# EAGLE schematic PowerloggerSch (EAGLE 9.7.0)

## Sheet 1 of 3
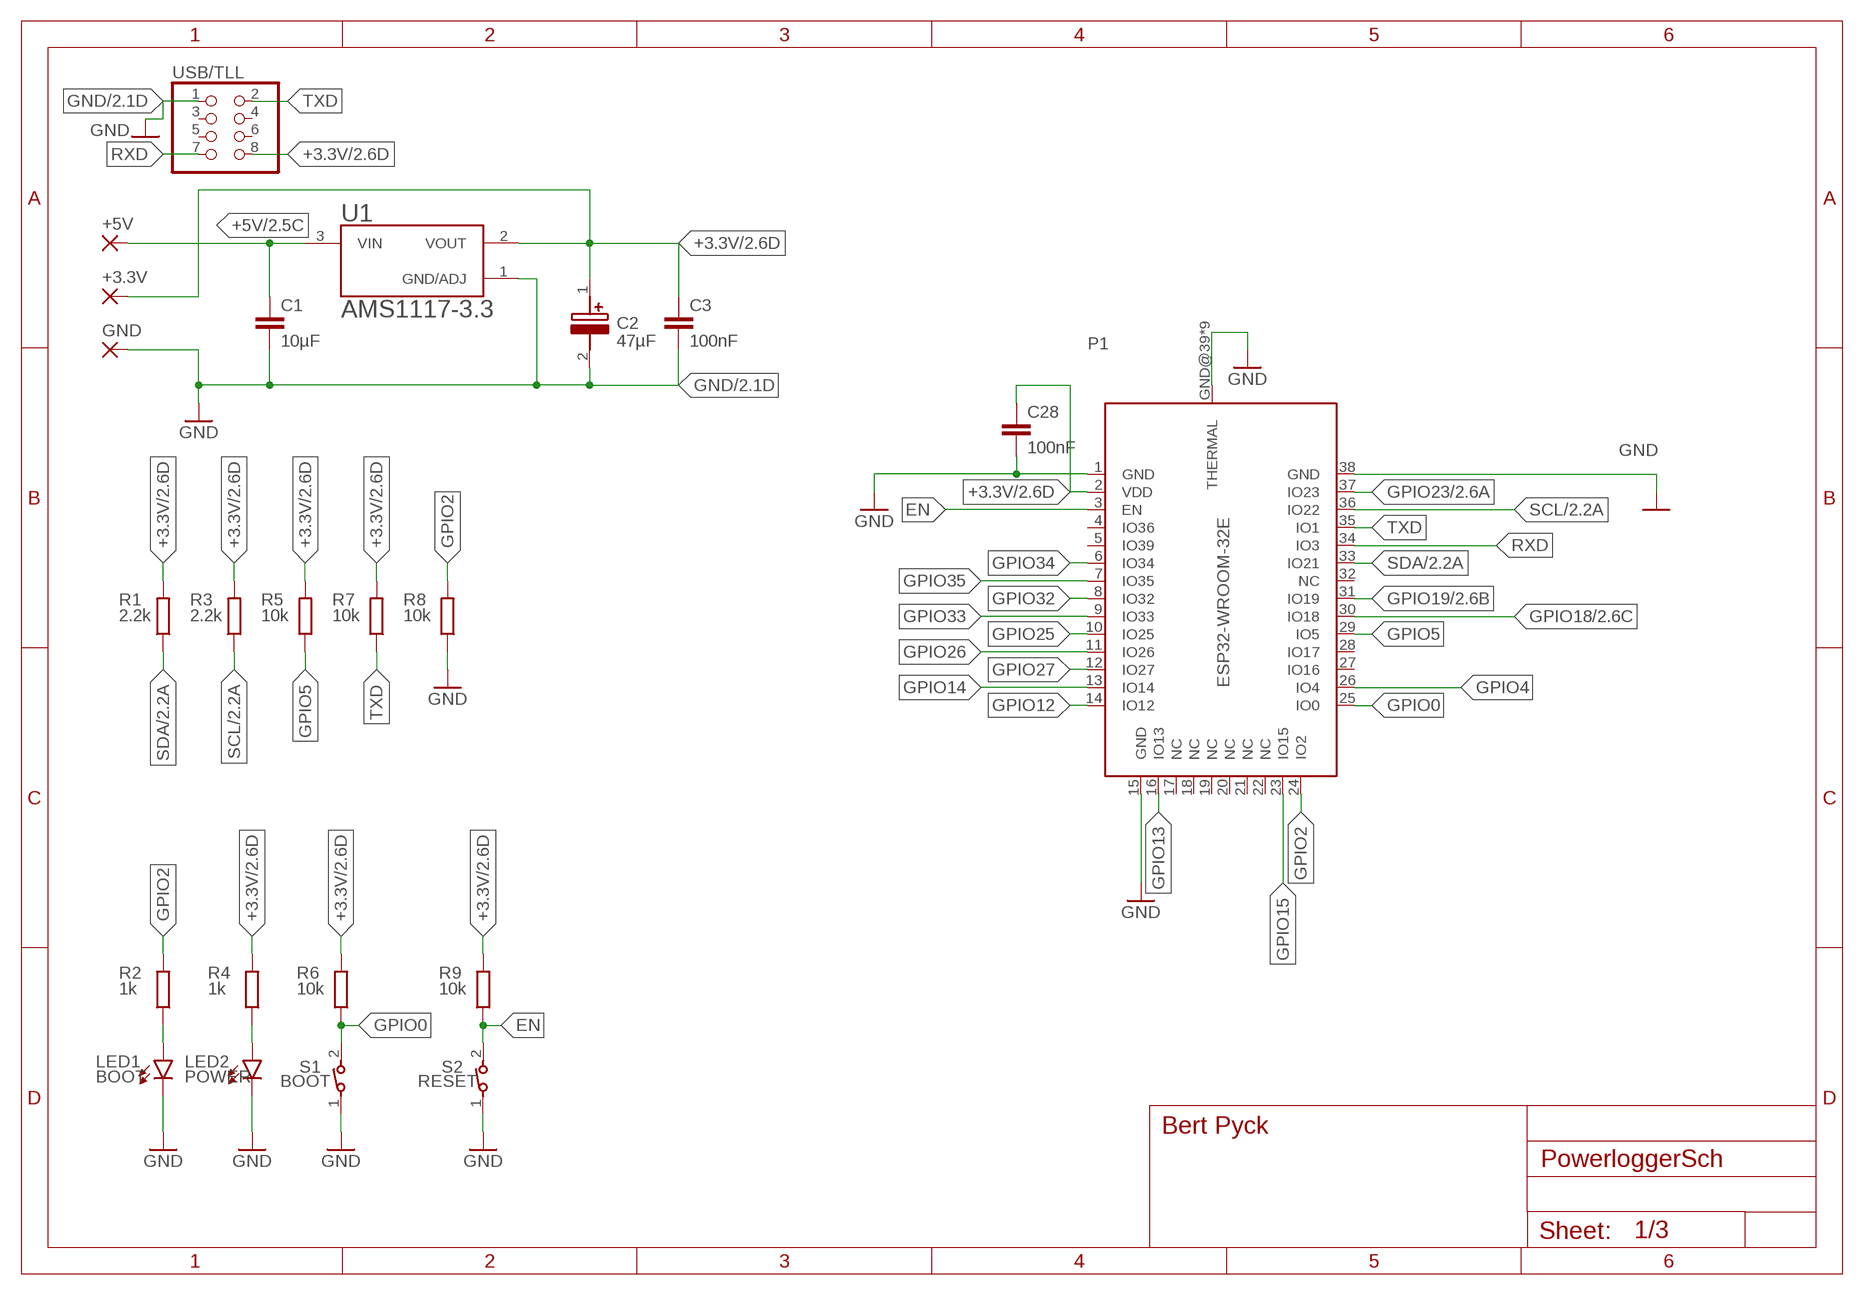
[diagram p0: schematic, sheet 1]

### Parts
+3.3V  SOLDERPAD  [SOLDERPAD]
+5V  SOLDERPAD  [SOLDERPAD]
C1  10µF  C-EUC1206  [C1206]
C2  47µF  865080543009  [CAPAE660X550N]
C3  100nF  C-EUC1206  [C1206]
C28  100nF  C-EUC1206  [C1206]
GND  SOLDERPAD  [SOLDERPAD]
LED1  BOOT  LEDCHIPLED_1206  [CHIPLED_1206]
LED2  POWER  LEDCHIPLED_1206  [CHIPLED_1206]
P1  ESP32-WROOM-32E  [ESP32-WROOM-32E]
R1  2.2k  R-EU_R1206  [R1206]
R2  1k  R-EU_R1206  [R1206]
R3  2.2k  R-EU_R1206  [R1206]
R4  1k  R-EU_R1206  [R1206]
R5  10k  R-EU_R1206  [R1206]
R6  10k  R-EU_R1206  [R1206]
R7  10k  R-EU_R1206  [R1206]
R8  10k  R-EU_R1206  [R1206]
R9  10k  R-EU_R1206  [R1206]
S1  BOOT  434111043826  [434111043826]
S2  RESET  434111043826  [434111043826]
U1  AMS1117-3.3  [SOT229P700X180-4N]
USB/TLL  PINHD-2X4  [2X04]

### Nets
+3.3V: +3.3V.1(P) C2.1(+) C3.1 C28.1 P1.2(VDD) R1.2 R3.2 R4.2 R5.2 R6.2 R7.2 R9.2 U1.2(VOUT) USB/TLL.8 ; also sheet 2
+5V: +5V.1(P) C1.1 U1.3(VIN) ; also sheet 2,3
EN: P1.3(EN) R9.1 S2.2
GND: C1.2 C2.2(-) C3.2 C28.2 GND.1(P) LED1.C LED2.C P1.1(GND) P1.15(GND) P1.38(GND) P1.GND@39(THERMAL) P1.GND@40(THERMAL) P1.GND@41(THERMAL) P1.GND@42(THERMAL) P1.GND@43(THERMAL) P1.GND@44(THERMAL) P1.GND@45(THERMAL) P1.GND@46(THERMAL) P1.GND@47(THERMAL) R8.1 S1.1 S2.1 U1.1(GND/ADJ) USB/TLL.1 ; also sheet 2,3
GPIO0: P1.25(IO0) R6.1 S1.2
GPIO2: P1.24(IO2) R2.2 R8.2
GPIO4: P1.26(IO4)
GPIO5: P1.29(IO5) R5.1
GPIO12: P1.14(IO12)
GPIO13: P1.16(IO13)
GPIO14: P1.13(IO14)
GPIO15: P1.23(IO15)
GPIO18: P1.30(IO18) ; also sheet 2
GPIO19: P1.31(IO19) ; also sheet 2
GPIO23: P1.37(IO23) ; also sheet 2
GPIO25: P1.10(IO25)
GPIO26: P1.11(IO26)
GPIO27: P1.12(IO27)
GPIO32: P1.8(IO32)
GPIO33: P1.9(IO33)
GPIO34: P1.6(IO34)
GPIO35: P1.7(IO35)
N$1: LED1.A R2.1
N$2: LED2.A R4.1
RXD: P1.34(IO3) USB/TLL.7
SCL: P1.36(IO22) R3.1 ; also sheet 2
SDA: P1.33(IO21) R1.1 ; also sheet 2
TXD: P1.35(IO1) R7.1 USB/TLL.2
Unconnected: P1.4(IO36) P1.5(IO39) P1.17(NC) P1.18(NC) P1.19(NC) P1.20(NC) P1.21(NC) P1.22(NC) P1.27(IO16) P1.28(IO17) P1.32(NC) USB/TLL.3 USB/TLL.4 USB/TLL.5 USB/TLL.6

### Notes on the sheet
- Bert Pyck

## Sheet 2 of 3
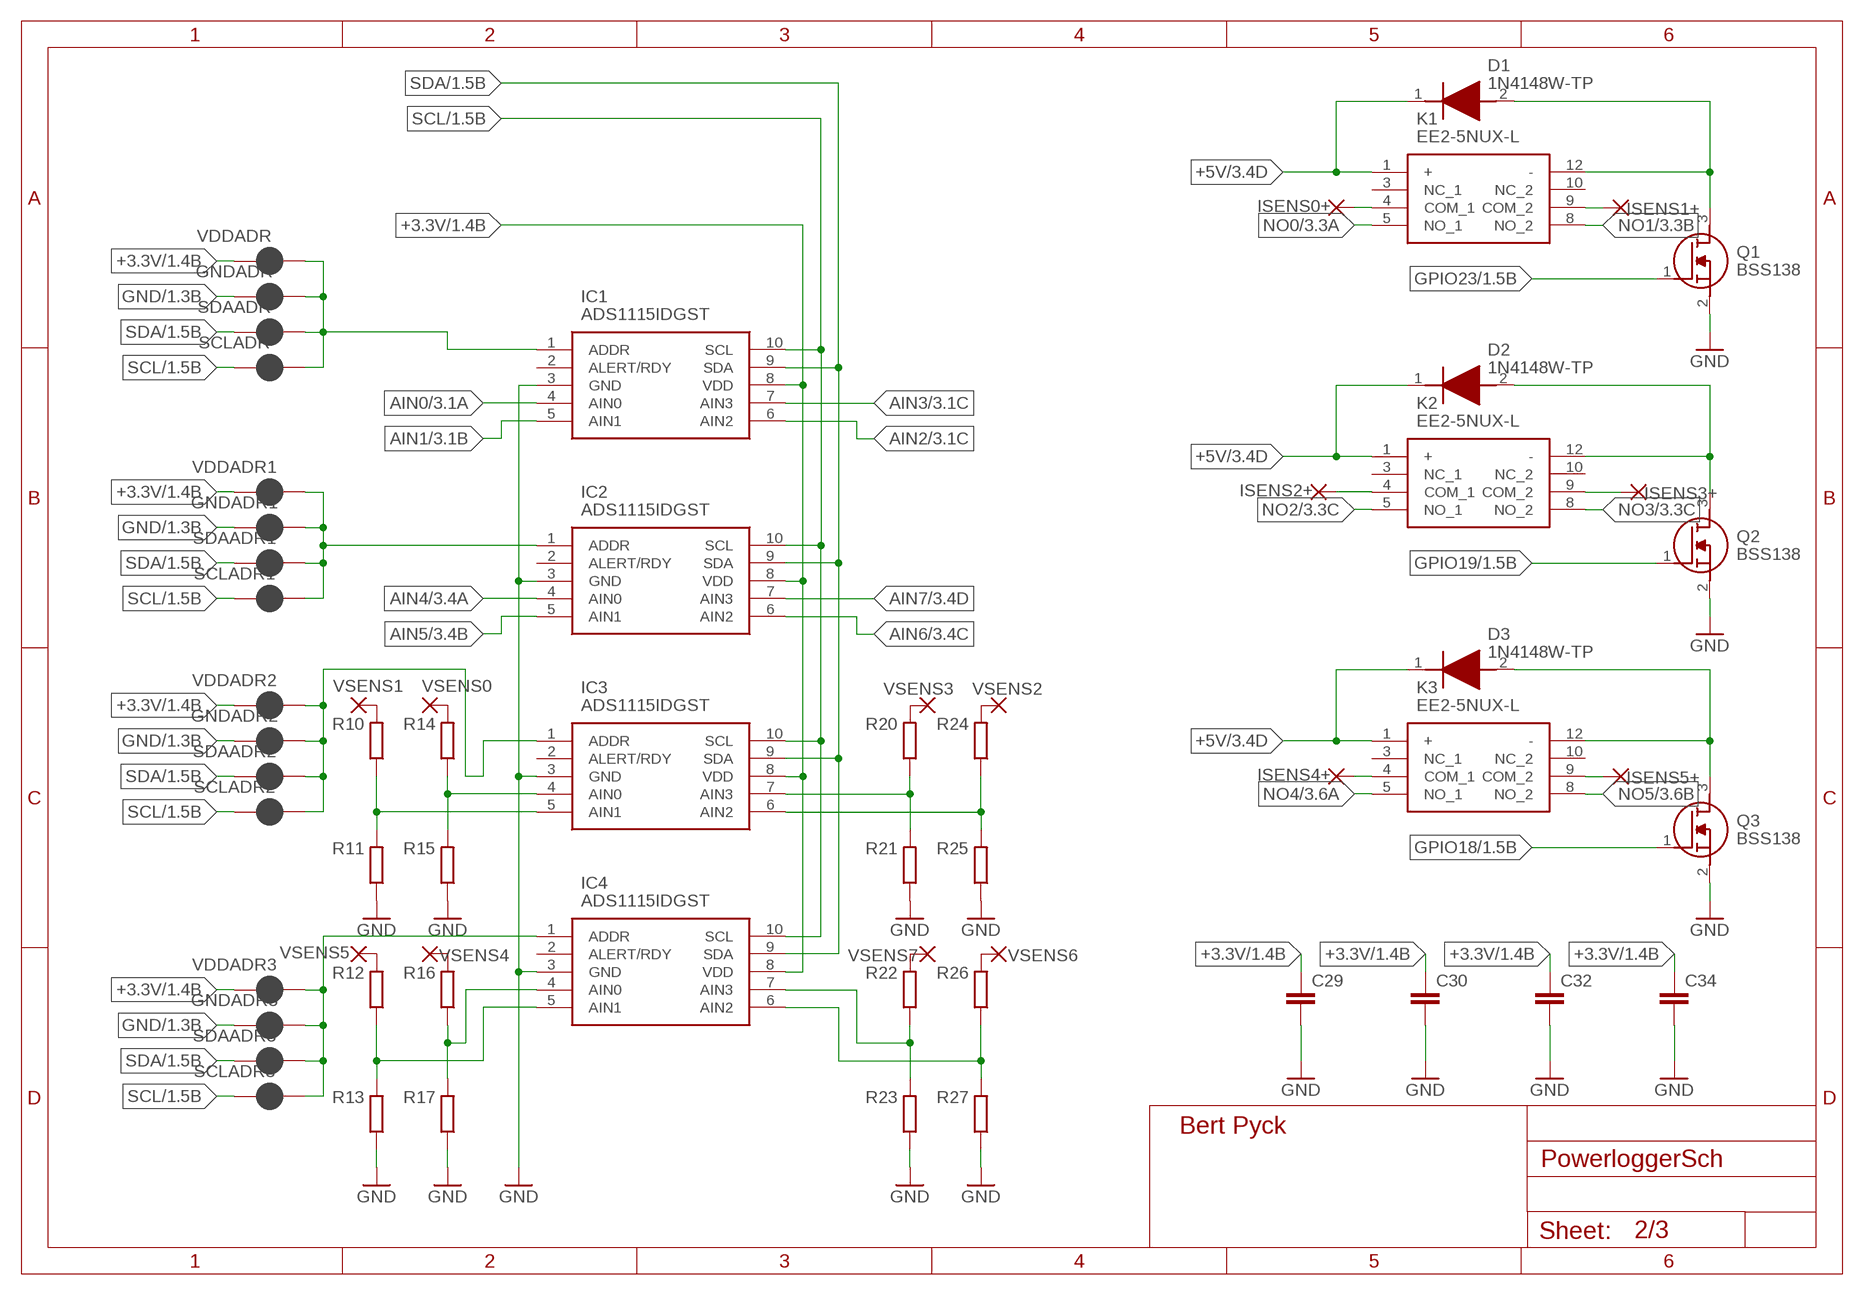
[diagram p1: schematic, sheet 2]

### Parts
C29  100nF  C-EUC1206  [C1206]
C30  100nF  C-EUC1206  [C1206]
C32  100nF  C-EUC1206  [C1206]
C34  100nF  C-EUC1206  [C1206]
D1  1N4148W-TP  [SOD3715X135N]
D2  1N4148W-TP  [SOD3715X135N]
D3  1N4148W-TP  [SOD3715X135N]
GNDADR  JUMPER-SMT_2_NC_PASTE_SILK  [SMT-JUMPER_2_NC_PASTE_SILK]
GNDADR1  JUMPER-SMT_2_NC_PASTE_SILK  [SMT-JUMPER_2_NC_PASTE_SILK]
GNDADR2  JUMPER-SMT_2_NC_PASTE_SILK  [SMT-JUMPER_2_NC_PASTE_SILK]
GNDADR3  JUMPER-SMT_2_NC_PASTE_SILK  [SMT-JUMPER_2_NC_PASTE_SILK]
IC1  ADS1115IDGST  [SOP50P490X110-10N]
IC2  ADS1115IDGST  [SOP50P490X110-10N]
IC3  ADS1115IDGST  [SOP50P490X110-10N]
IC4  ADS1115IDGST  [SOP50P490X110-10N]
ISENS0+  SOLDERPAD  [SOLDERPAD]
ISENS1+  SOLDERPAD  [SOLDERPAD]
ISENS2+  SOLDERPAD  [SOLDERPAD]
ISENS3+  SOLDERPAD  [SOLDERPAD]
ISENS4+  SOLDERPAD  [SOLDERPAD]
ISENS5+  SOLDERPAD  [SOLDERPAD]
K1  EE2-5NUX-L  [EE25NUXL]
K2  EE2-5NUX-L  [EE25NUXL]
K3  EE2-5NUX-L  [EE25NUXL]
Q1  BSS138  [SOT95P240X120-3N]
Q2  BSS138  [SOT95P240X120-3N]
Q3  BSS138  [SOT95P240X120-3N]
R10  R-EU_R1206  [R1206]
R11  R-EU_R1206  [R1206]
R12  R-EU_R1206  [R1206]
R13  R-EU_R1206  [R1206]
R14  R-EU_R1206  [R1206]
R15  R-EU_R1206  [R1206]
R16  R-EU_R1206  [R1206]
R17  R-EU_R1206  [R1206]
R20  R-EU_R1206  [R1206]
R21  R-EU_R1206  [R1206]
R22  R-EU_R1206  [R1206]
R23  R-EU_R1206  [R1206]
R24  R-EU_R1206  [R1206]
R25  R-EU_R1206  [R1206]
R26  R-EU_R1206  [R1206]
R27  R-EU_R1206  [R1206]
SCLADR  JUMPER-SMT_2_NC_PASTE_SILK  [SMT-JUMPER_2_NC_PASTE_SILK]
SCLADR1  JUMPER-SMT_2_NC_PASTE_SILK  [SMT-JUMPER_2_NC_PASTE_SILK]
SCLADR2  JUMPER-SMT_2_NC_PASTE_SILK  [SMT-JUMPER_2_NC_PASTE_SILK]
SCLADR3  JUMPER-SMT_2_NC_PASTE_SILK  [SMT-JUMPER_2_NC_PASTE_SILK]
SDAADR  JUMPER-SMT_2_NC_PASTE_SILK  [SMT-JUMPER_2_NC_PASTE_SILK]
SDAADR1  JUMPER-SMT_2_NC_PASTE_SILK  [SMT-JUMPER_2_NC_PASTE_SILK]
SDAADR2  JUMPER-SMT_2_NC_PASTE_SILK  [SMT-JUMPER_2_NC_PASTE_SILK]
SDAADR3  JUMPER-SMT_2_NC_PASTE_SILK  [SMT-JUMPER_2_NC_PASTE_SILK]
VDDADR  JUMPER-SMT_2_NC_PASTE_SILK  [SMT-JUMPER_2_NC_PASTE_SILK]
VDDADR1  JUMPER-SMT_2_NC_PASTE_SILK  [SMT-JUMPER_2_NC_PASTE_SILK]
VDDADR2  JUMPER-SMT_2_NC_PASTE_SILK  [SMT-JUMPER_2_NC_PASTE_SILK]
VDDADR3  JUMPER-SMT_2_NC_PASTE_SILK  [SMT-JUMPER_2_NC_PASTE_SILK]
VSENS0  SOLDERPAD  [SOLDERPAD]
VSENS1  SOLDERPAD  [SOLDERPAD]
VSENS2  SOLDERPAD  [SOLDERPAD]
VSENS3  SOLDERPAD  [SOLDERPAD]
VSENS4  SOLDERPAD  [SOLDERPAD]
VSENS5  SOLDERPAD  [SOLDERPAD]
VSENS6  SOLDERPAD  [SOLDERPAD]
VSENS7  SOLDERPAD  [SOLDERPAD]

### Nets
+3.3V: C29.1 C30.1 C32.1 C34.1 IC1.8(VDD) IC2.8(VDD) IC3.8(VDD) IC4.8(VDD) VDDADR1.1 VDDADR2.1 VDDADR3.1 VDDADR.1 ; also sheet 1
+5V: D1.1(K) D2.1(K) D3.1(K) K1.1(+) K2.1(+) K3.1(+) ; also sheet 1,3
AIN0: IC1.4(AIN0) ; also sheet 3
AIN1: IC1.5(AIN1) ; also sheet 3
AIN2: IC1.6(AIN2) ; also sheet 3
AIN3: IC1.7(AIN3) ; also sheet 3
AIN4: IC2.4(AIN0) ; also sheet 3
AIN5: IC2.5(AIN1) ; also sheet 3
AIN6: IC2.6(AIN2) ; also sheet 3
AIN7: IC2.7(AIN3) ; also sheet 3
GND: C29.2 C30.2 C32.2 C34.2 GNDADR1.1 GNDADR2.1 GNDADR3.1 GNDADR.1 IC1.3(GND) IC2.3(GND) IC3.3(GND) IC4.3(GND) Q1.2(S) Q2.2(S) Q3.2(S) R11.1 R13.1 R15.1 R17.1 R21.1 R23.1 R25.1 R27.1 ; also sheet 1,3
GPIO18: Q3.1(G) ; also sheet 1
GPIO19: Q2.1(G) ; also sheet 1
GPIO23: Q1.1(G) ; also sheet 1
N$3: D1.2(A) K1.12(-) Q1.3(D)
N$5: ISENS0+.1(P) K1.4(COM_1)
N$6: ISENS2+.1(P) K2.4(COM_1)
N$7: IC3.4(AIN0) R14.1 R15.2
N$8: ISENS1+.1(P) K1.9(COM_2)
N$9: ISENS3+.1(P) K2.9(COM_2)
N$10: D2.2(A) K2.12(-) Q2.3(D)
N$11: IC3.5(AIN1) R10.1 R11.2
N$12: IC4.4(AIN0) R16.1 R17.2
N$13: IC4.5(AIN1) R12.1 R13.2
N$14: IC3.7(AIN3) R20.1 R21.2
N$15: IC3.6(AIN2) R24.1 R25.2
N$16: IC4.7(AIN3) R22.1 R23.2
N$17: D3.2(A) K3.12(-) Q3.3(D)
N$18: IC4.6(AIN2) R26.1 R27.2
N$19: ISENS4+.1(P) K3.4(COM_1)
N$20: R10.2 VSENS1.1(P)
N$21: R14.2 VSENS0.1(P)
N$22: ISENS5+.1(P) K3.9(COM_2)
N$23: R20.2 VSENS3.1(P)
N$24: GNDADR.2 IC1.1(ADDR) SCLADR.2 SDAADR.2 VDDADR.2
N$25: GNDADR1.2 IC2.1(ADDR) SCLADR1.2 SDAADR1.2 VDDADR1.2
N$31: R24.2 VSENS2.1(P)
N$35: R12.2 VSENS5.1(P)
N$40: R16.2 VSENS4.1(P)
N$45: R22.2 VSENS7.1(P)
N$50: R26.2 VSENS6.1(P)
N$55: GNDADR3.2 IC4.1(ADDR) SCLADR3.2 SDAADR3.2 VDDADR3.2
N$67: GNDADR2.2 IC3.1(ADDR) SCLADR2.2 SDAADR2.2 VDDADR2.2
NO0: K1.5(NO_1) ; also sheet 3
NO1: K1.8(NO_2) ; also sheet 3
NO2: K2.5(NO_1) ; also sheet 3
NO3: K2.8(NO_2) ; also sheet 3
NO4: K3.5(NO_1) ; also sheet 3
NO5: K3.8(NO_2) ; also sheet 3
SCL: IC1.10(SCL) IC2.10(SCL) IC3.10(SCL) IC4.10(SCL) SCLADR1.1 SCLADR2.1 SCLADR3.1 SCLADR.1 ; also sheet 1
SDA: IC1.9(SDA) IC2.9(SDA) IC3.9(SDA) IC4.9(SDA) SDAADR1.1 SDAADR2.1 SDAADR3.1 SDAADR.1 ; also sheet 1
Unconnected: IC1.2(ALERT/RDY) IC2.2(ALERT/RDY) IC3.2(ALERT/RDY) IC4.2(ALERT/RDY) K1.3(NC_1) K1.10(NC_2) K2.3(NC_1) K2.10(NC_2) K3.3(NC_1) K3.10(NC_2)

### Notes on the sheet
- Bert Pyck

## Sheet 3 of 3
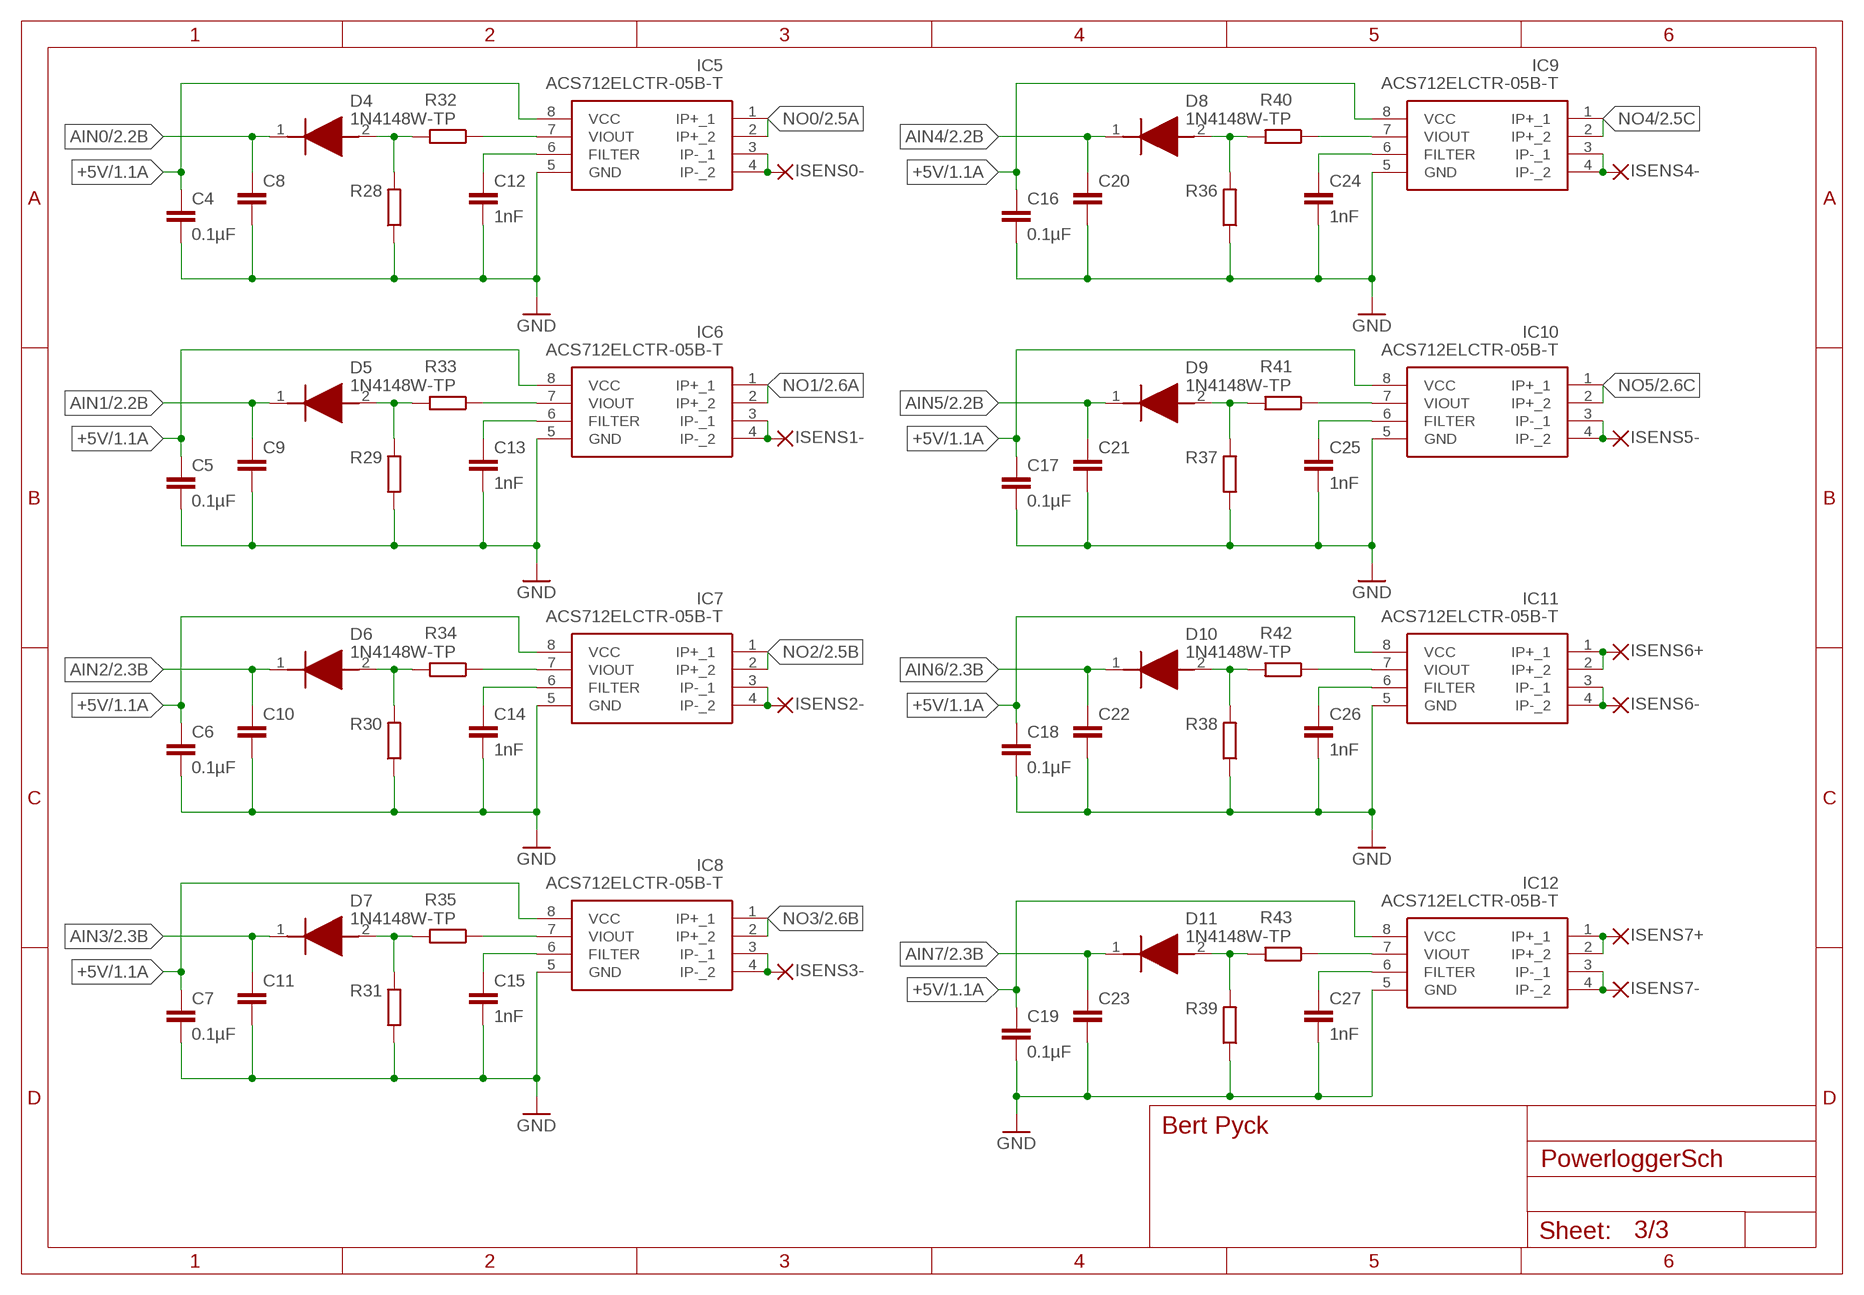
[diagram p2: schematic, sheet 3]

### Parts
C4  0.1µF  C-EUC1206  [C1206]
C5  0.1µF  C-EUC1206  [C1206]
C6  0.1µF  C-EUC1206  [C1206]
C7  0.1µF  C-EUC1206  [C1206]
C8  C-EUC1206  [C1206]
C9  C-EUC1206  [C1206]
C10  C-EUC1206  [C1206]
C11  C-EUC1206  [C1206]
C12  1nF  C-EUC1206  [C1206]
C13  1nF  C-EUC1206  [C1206]
C14  1nF  C-EUC1206  [C1206]
C15  1nF  C-EUC1206  [C1206]
C16  0.1µF  C-EUC1206  [C1206]
C17  0.1µF  C-EUC1206  [C1206]
C18  0.1µF  C-EUC1206  [C1206]
C19  0.1µF  C-EUC1206  [C1206]
C20  C-EUC1206  [C1206]
C21  C-EUC1206  [C1206]
C22  C-EUC1206  [C1206]
C23  C-EUC1206  [C1206]
C24  1nF  C-EUC1206  [C1206]
C25  1nF  C-EUC1206  [C1206]
C26  1nF  C-EUC1206  [C1206]
C27  1nF  C-EUC1206  [C1206]
D4  1N4148W-TP  [SOD3715X135N]
D5  1N4148W-TP  [SOD3715X135N]
D6  1N4148W-TP  [SOD3715X135N]
D7  1N4148W-TP  [SOD3715X135N]
D8  1N4148W-TP  [SOD3715X135N]
D9  1N4148W-TP  [SOD3715X135N]
D10  1N4148W-TP  [SOD3715X135N]
D11  1N4148W-TP  [SOD3715X135N]
IC5  ACS712ELCTR-05B-T  [SOIC127P600X175-8N]
IC6  ACS712ELCTR-05B-T  [SOIC127P600X175-8N]
IC7  ACS712ELCTR-05B-T  [SOIC127P600X175-8N]
IC8  ACS712ELCTR-05B-T  [SOIC127P600X175-8N]
IC9  ACS712ELCTR-05B-T  [SOIC127P600X175-8N]
IC10  ACS712ELCTR-05B-T  [SOIC127P600X175-8N]
IC11  ACS712ELCTR-05B-T  [SOIC127P600X175-8N]
IC12  ACS712ELCTR-05B-T  [SOIC127P600X175-8N]
ISENS0-  SOLDERPAD  [SOLDERPAD]
ISENS1-  SOLDERPAD  [SOLDERPAD]
ISENS2-  SOLDERPAD  [SOLDERPAD]
ISENS3-  SOLDERPAD  [SOLDERPAD]
ISENS4-  SOLDERPAD  [SOLDERPAD]
ISENS5-  SOLDERPAD  [SOLDERPAD]
ISENS6+  SOLDERPAD  [SOLDERPAD]
ISENS6-  SOLDERPAD  [SOLDERPAD]
ISENS7+  SOLDERPAD  [SOLDERPAD]
ISENS7-  SOLDERPAD  [SOLDERPAD]
R28  R-EU_R1206  [R1206]
R29  R-EU_R1206  [R1206]
R30  R-EU_R1206  [R1206]
R31  R-EU_R1206  [R1206]
R32  R-EU_R1206  [R1206]
R33  R-EU_R1206  [R1206]
R34  R-EU_R1206  [R1206]
R35  R-EU_R1206  [R1206]
R36  R-EU_R1206  [R1206]
R37  R-EU_R1206  [R1206]
R38  R-EU_R1206  [R1206]
R39  R-EU_R1206  [R1206]
R40  R-EU_R1206  [R1206]
R41  R-EU_R1206  [R1206]
R42  R-EU_R1206  [R1206]
R43  R-EU_R1206  [R1206]

### Nets
+5V: C4.1 C5.1 C6.1 C7.1 C16.1 C17.1 C18.1 C19.1 IC5.8(VCC) IC6.8(VCC) IC7.8(VCC) IC8.8(VCC) IC9.8(VCC) IC10.8(VCC) IC11.8(VCC) IC12.8(VCC) ; also sheet 1,2
AIN0: C8.1 D4.1(K) ; also sheet 2
AIN1: C9.1 D5.1(K) ; also sheet 2
AIN2: C10.1 D6.1(K) ; also sheet 2
AIN3: C11.1 D7.1(K) ; also sheet 2
AIN4: C20.1 D8.1(K) ; also sheet 2
AIN5: C21.1 D9.1(K) ; also sheet 2
AIN6: C22.1 D10.1(K) ; also sheet 2
AIN7: C23.1 D11.1(K) ; also sheet 2
GND: C4.2 C5.2 C6.2 C7.2 C8.2 C9.2 C10.2 C11.2 C12.2 C13.2 C14.2 C15.2 C16.2 C17.2 C18.2 C19.2 C20.2 C21.2 C22.2 C23.2 C24.2 C25.2 C26.2 C27.2 IC5.5(GND) IC6.5(GND) IC7.5(GND) IC8.5(GND) IC9.5(GND) IC10.5(GND) IC11.5(GND) IC12.5(GND) R28.1 R29.1 R30.1 R31.1 R36.1 R37.1 R38.1 R39.1 ; also sheet 1,2
N$27: C12.1 IC5.6(FILTER)
N$28: IC5.7(VIOUT) R32.1
N$29: D4.2(A) R28.2 R32.2
N$30: C13.1 IC6.6(FILTER)
N$32: IC5.3(IP-_1) IC5.4(IP-_2) ISENS0-.1(P)
N$33: IC6.7(VIOUT) R33.1
N$34: D5.2(A) R29.2 R33.2
N$36: IC6.3(IP-_1) IC6.4(IP-_2) ISENS1-.1(P)
N$37: C14.1 IC7.6(FILTER)
N$38: IC7.7(VIOUT) R34.1
N$39: D6.2(A) R30.2 R34.2
N$41: IC7.3(IP-_1) IC7.4(IP-_2) ISENS2-.1(P)
N$42: C15.1 IC8.6(FILTER)
N$43: IC8.7(VIOUT) R35.1
N$44: D7.2(A) R31.2 R35.2
N$46: IC8.3(IP-_1) IC8.4(IP-_2) ISENS3-.1(P)
N$47: C24.1 IC9.6(FILTER)
N$48: IC9.7(VIOUT) R40.1
N$49: D8.2(A) R36.2 R40.2
N$51: IC9.3(IP-_1) IC9.4(IP-_2) ISENS4-.1(P)
N$52: C25.1 IC10.6(FILTER)
N$53: IC10.7(VIOUT) R41.1
N$54: D9.2(A) R37.2 R41.2
N$56: IC10.3(IP-_1) IC10.4(IP-_2) ISENS5-.1(P)
N$57: C26.1 IC11.6(FILTER)
N$58: IC11.7(VIOUT) R42.1
N$59: D10.2(A) R38.2 R42.2
N$60: IC11.1(IP+_1) IC11.2(IP+_2) ISENS6+.1(P)
N$61: IC11.3(IP-_1) IC11.4(IP-_2) ISENS6-.1(P)
N$62: C27.1 IC12.6(FILTER)
N$63: IC12.7(VIOUT) R43.1
N$64: D11.2(A) R39.2 R43.2
N$65: IC12.1(IP+_1) IC12.2(IP+_2) ISENS7+.1(P)
N$66: IC12.3(IP-_1) IC12.4(IP-_2) ISENS7-.1(P)
NO0: IC5.1(IP+_1) IC5.2(IP+_2) ; also sheet 2
NO1: IC6.1(IP+_1) IC6.2(IP+_2) ; also sheet 2
NO2: IC7.1(IP+_1) IC7.2(IP+_2) ; also sheet 2
NO3: IC8.1(IP+_1) IC8.2(IP+_2) ; also sheet 2
NO4: IC9.1(IP+_1) IC9.2(IP+_2) ; also sheet 2
NO5: IC10.1(IP+_1) IC10.2(IP+_2) ; also sheet 2

### Notes on the sheet
- Bert Pyck

## Library data of the parts
+3.3V +5V GND ISENS0+ ISENS0- ISENS1+ ISENS1- ISENS2+ ISENS2- ISENS3+ ISENS3- ISENS4+ ISENS4- ISENS5+ ISENS5- ISENS6+ ISENS6- ISENS7+ ISENS7- VSENS0 VSENS1-VSENS7 = LibraryLEDs:SOLDERPAD: SMD PAD
C1 C3-C30 C32 C34 = resistor:C-EU: CAPACITOR, European symbol
C2 = 865080543009:865080543009: Wurth Elektronik 47uF 35 V dc Aluminium Electrolytic Capacitor, WCAP-ASLI Series 2000h 6.3 (Dia.) x 5.35mm Source: Datasheet <https://katalog.we-online.de/pbs/datasheet/865080543009.pdf>; DESCRIPTION: Wurth Elektronik 47uF 35 V dc Aluminium Electrolytic Capacitor, WCAP-ASLI Series 2000h 6.3 (Dia.) x 5.35mm; HEIGHT: 5.5mm; MANUFACTURER_NAME: Wurth Elektronik; MANUFACTURER_PART_NUMBER: 865080543009; MOUSER_PART_NUMBER: 710-865080543009; MOUSER_PRICE-STOCK: https://www.mouser.co.uk/ProductDetail/Wurth-Elektronik/865080543009?qs=0KOYDY2FL2%2F%252BYmhMLtEhDQ%3D%3D
D1-D11 = 1N4148W-TP:1N4148W-TP: Switching Diodes Source: Datasheet <https://mccsemi.com/pdf/Products/1N4148W(SOD-123).pdf>; DESCRIPTION: Switching Diodes; HEIGHT: 1.35mm; MANUFACTURER_NAME: MCC; MANUFACTURER_PART_NUMBER: 1N4148W-TP; MOUSER_PART_NUMBER: 833-1N4148W-TP; MOUSER_PRICE-STOCK: https://www.mouser.co.uk/ProductDetail/Micro-Commercial-Components-MCC/1N4148W-TP?qs=KFo7JewZbUH7wCMabJ4EeQ%3D%3D
GNDADR GNDADR1-GNDADR3 SCLADR SCLADR1-SCLADR3 SDAADR SDAADR1-SDAADR3 VDDADR VDDADR1-VDDADR3 = SparkFun-Jumpers:JUMPER-SMT_2_NC_PASTE: Normally closed solder jumper This jumper has an aperture in the stencil to allow solder paste to bridge the split in the wire so it's normally closed (NC). Wick off the solder to open the connection. Reapply solder to reclose the connection.
IC1-IC4 = ADS1115IDGST:ADS1115IDGST: 16-Bit, 860SPS, 4-Ch Delta-Sigma ADC w/ PGA, Oscillator, Voltage Reference, Comparator & I2C Source: Datasheet <https://datasheet.datasheetarchive.com/originals/distributors/Datasheets-SFU2/DSASFU100025989.pdf>; DESCRIPTION: 16-Bit, 860SPS, 4-Ch Delta-Sigma ADC w/ PGA, Oscillator, Voltage Reference, Comparator & I2C; HEIGHT: 1.1mm; MANUFACTURER_NAME: Texas Instruments; MANUFACTURER_PART_NUMBER: ADS1115IDGST; MOUSER_PART_NUMBER: 595-ADS1115IDGST; MOUSER_PRICE-STOCK: https://www.mouser.co.uk/ProductDetail/Texas-Instruments/ADS1115IDGST?qs=6805eV47HhY3JIwOhQ2zog%3D%3D
IC5-IC12 = ACS712ELCTR-05B-T:ACS712ELCTR-05B-T: Fully Integrated, Hall-Effect-Based Linear Current Sensor IC with 2.1 kVRMS Voltage Isolation and a Low-Resistance Current Conductor Source: Datasheet <https://www.allegromicro.com/~/media/Files/Datasheets/ACS712-Datasheet.ashx>; DESCRIPTION: Fully Integrated, Hall-Effect-Based Linear Current Sensor IC with 2.1 kVRMS Voltage Isolation and a Low-Resistance Current Conductor; HEIGHT: 1.75mm; MANUFACTURER_NAME: Allegro Microsystems; MANUFACTURER_PART_NUMBER: ACS712ELCTR-05B-T; MOUSER_PART_NUMBER: 250-712ELCTR05BT; MOUSER_PRICE-STOCK: https://www.mouser.co.uk/ProductDetail/Allegro-MicroSystems/ACS712ELCTR-05B-T?qs=pUKx8fyJudDs65Rkshv5ug%3D%3D
K1-K3 = EE2-5NUX-L:EE2-5NUX-L: KEMET, EE2, Relays, Signal, 5 V, 220 V, 250 VAC, 2 A, 75 mOhms, 1 GOhms, 15mm, 7.5mm, 10.35mm Source: Datasheet <https://content.kemet.com/datasheets/KEM_R7002_EC2_EE2.pdf>; DESCRIPTION: KEMET, EE2, Relays, Signal, 5 V, 220 V, 250 VAC, 2 A, 75 mOhms, 1 GOhms, 15mm, 7.5mm, 10.35mm; HEIGHT: 10.35mm; MANUFACTURER_NAME: KEMET; MANUFACTURER_PART_NUMBER: EE2-5NUX-L; MOUSER_PART_NUMBER: 80-EE2-5NUX-L; MOUSER_PRICE-STOCK: https://www.mouser.co.uk/ProductDetail/KEMET/EE2-5NUX-L?qs=UeqeubEbzTWGy72jgjuAog%3D%3D
LED1 LED2 = led:LED: LED OSRAM: - CHIPLED LG R971, LG N971, LY N971, LG Q971, LY Q971, LO R971, LY R971 LH N974, LH R974 LS Q976, LO Q976, LY Q976 LO Q996 - Hyper CHIPLED LW Q18S LB Q993, LB Q99A, LB R99A - SideLED LS A670, LO A670, LY A670, LG A670, LP A670 LB A673, LV A673, LT A673, LW A673 LH A674 LY A675 LS A676, LA A676, LO A676, LY A676, LW A676 LS A679, LY A679, LG A679 - Hyper Micro SIDELED® LS Y876, LA Y876, LO Y876, LY Y876 LT Y87S - SmartLED LW L88C, LW L88S LB L89C, LB L89S, LG L890 LS L89K, LO L89K, LY L89K LS L896, LA L896, LO L896, LY L896 - TOPLED LS T670, LO T670, LY T670, LG T670, LP T670 LSG T670, LSP T670, LSY T670, LOP T670, LYG T670 LG T671, LOG T671, LSG T671 LB T673, LV T673, LT T673, LW T673 LH T674 LS T676, LA T676, LO T676, LY T676, LB T676, LH T676, LSB T676, LW T676 LB T67C, LV T67C, LT T67C, LS T67K, LO T67K, LY T67K, LW E67C LS E67B, LA E67B, LO E67B, LY E67B, LB E67C, LV E67C, LT E67C LW T67C LS T679, LY T679, LG T679 LS T770, LO T770, LY T770, LG T770, LP T770 LB T773, LV T773, LT T773, LW T773 LH T774 LS E675, LA E675, LY E675, LS T675 LS T776, LA T776, LO T776, LY T776, LB T776 LHGB T686 LT T68C, LB T68C - Hyper Mini TOPLED® LB M676 - Mini TOPLED Santana® LG M470 LS M47K, LO M47K, LY M47K Source: http://www.osram.convergy.de LUXEON: - LUMILED® LXK2-PW12-R00, LXK2-PW12-S00, LXK2-PW14-U00, LXK2-PW14-V00 LXK2-PM12-R00, LXK2-PM12-S00, LXK2-PM14-U00 LXK2-PE12-Q00, LXK2-PE12-R00, LXK2-PE12-S00, LXK2-PE14-T00, LXK2-PE14-U00 LXK2-PB12-K00, LXK2-PB12-L00, LXK2-PB12-M00, LXK2-PB14-N00, LXK2-PB14-P00, LXK2-PB14-Q00 LXK2-PR12-L00, LXK2-PR12-M00, LXK2-PR14-Q00, LXK2-PR14-R00 LXK2-PD12-Q00, LXK2-PD12-R00, LXK2-PD12-S00 LXK2-PH12-R00, LXK2-PH12-S00 LXK2-PL12-P00, LXK2-PL12-Q00, LXK2-PL12-R00 Source: www.luxeon.com KINGBRIGHT: KA-3528ASYC Source: www.kingbright.com
P1 = LibraryESP:ESP32-WROOM-32E: Check availability <https://pricing.snapeda.com/parts/ESP32-WROOM-32E/Espressif%20Systems/view-part?ref=eda>; AVAILABILITY: In Stock; CHECK_PRICES: https://www.snapeda.com/parts/ESP32-WROOM-32E/Espressif+Systems/view-part/?ref=eda; DESCRIPTION: RX TXRX MOD WIFI TRACE ANT SMD; MF: Espressif Systems; MP: ESP32-WROOM-32E; PACKAGE: SMD-44 Espressif Systems; PRICE: None; SNAPEDA_LINK: https://www.snapeda.com/parts/ESP32-WROOM-32E/Espressif+Systems/view-part/?ref=snap
Q1-Q3 = BSS138:BSS138: N-channel MOSFET,BSS138 0.2A 50V Source: Datasheet <https://www.onsemi.com/pub/Collateral/BSS138-D.PDF>; DESCRIPTION: N-channel MOSFET,BSS138 0.2A 50V; HEIGHT: 1.2mm; MANUFACTURER_NAME: onsemi; MANUFACTURER_PART_NUMBER: BSS138; MOUSER_PART_NUMBER: 512-BSS138; MOUSER_PRICE-STOCK: https://www.mouser.co.uk/ProductDetail/onsemi-Fairchild/BSS138?qs=HK%252BeIG1iaahCeqBvjB4arg%3D%3D
R1-R17 R20-R43 = resistor:R-EU_: RESISTOR, European symbol
S1 S2 = 434111043826:434111043826: WS-TASV SMT Tact Switch 6.0x3.5 mm MATERIAL PROPERTIES Cover Material Stainless Steel PROPERTIES Actuator Material LCP Actuator Flammability Rating UL94 V-0 Actuator Color Black; Salmon; White Frame Material LCP Frame Flammability Rating UL94 V-0 Frame Color Black; White Contact Material Stainless Steel Contact Plating Silver Terminal Material Copper Alloy Terminal Plating Silver VR 12 V (DC) Contact Resistance Initial 100 mΩ Contact Resistance After Life Test 1 Ω RISO 100 MΩ Withstanding Voltage 250 V (AC) Washable No Qty. 1500; 1800 Mechanical Properties Stroke 0.25 mm GENERAL INFORMATION Operating Temperature -40 up to +85 °C PACKAGING PROPERTIES Packaging Tape and Reel <https://www.we-online.com/catalog/media/o37582v209%20WS-TASV_4341X1XXX8X6_Family.jpg> Details see: https://www.we-online.com/catalog/en/TASV_6_0X3_5_SMD/ Created by Yingchun,Shan 2020-02-20 2020(C) Wurth Elektronik Check availability <https://pricing.snapeda.com/parts/434111043826/Wurth%20Electronics/view-part?ref=eda>; AVAILABILITY: Not in stock; CHECK_PRICES: https://www.snapeda.com/parts/434111043826/Wurth+Electronics+Inc./view-part/?ref=eda; DESCRIPTION: Tactile Switch SPST-NO Top Actuated Surface Mount; MF: Wurth Electronics; MP: 434111043826; PACKAGE: None; PRICE: None; PURCHASE-URL: https://www.snapeda.com/api/url_track_click_mouser/?unipart_id=4218709&manufacturer=Wurth Electronics&part_name=434111043826&search_term=434111043826; SNAPEDA_LINK: https://www.snapeda.com/parts/434111043826/Wurth+Electronics+Inc./view-part/?ref=snap
U1 = AMS1117-3.3:AMS1117-3.3: Check availability <https://pricing.snapeda.com/parts/AMS1117-3.3/Advanced%20Monolithic%20Systems/view-part?ref=eda>; AVAILABILITY: Not in stock; CHECK_PRICES: https://www.snapeda.com/parts/AMS1117-3.3/Advanced+Monolithic+Systems/view-part/?ref=eda; DESCRIPTION: Sot223/Pkg 1-Amp 3.3-Volt Low Drop Out Voltage Regulatator; MF: Advanced Monolithic Systems; MP: AMS1117-3.3; PACKAGE: SOT-223 Seeed Technology; PRICE: None; SNAPEDA_LINK: https://www.snapeda.com/parts/AMS1117-3.3/Advanced+Monolithic+Systems/view-part/?ref=snap
USB/TLL = Connector:PINHD-2X4: PIN HEADER; CATEGORY: Headers; DESCRIPTION: Header, Straight, 2x4 Position; MANUFACTURER: Generic; MPN: Generic; OPERATING_TEMPERATURE: Generic; PART_STATUS: Active; PITCH: 0.100" (2.54mm); ROHS_COMPLIANCE: Generic; SERIES: Generic; SUB-CATEGORY: Headers, Male Pins; TYPE: Board to Board or Cable, Unshrouded, Through Hole, Straight